# EAGLE design FeatherTPL5010 (EAGLE 9.6.2)
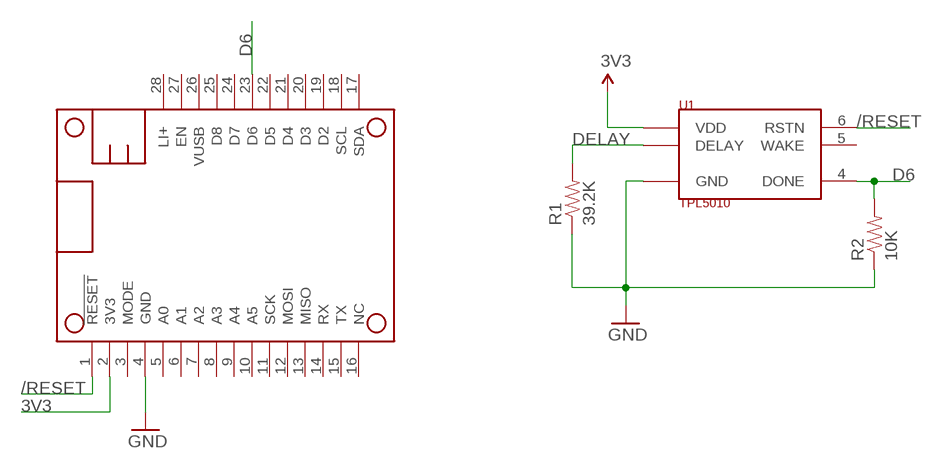
[diagram p0: schematic, sheet 1]

## Parts
MS1  FEATHERWING_NODIM  [FEATHERWING_NODIM]
R1  39.2K  RES-39.2K-0603  [0603-RES]
R2  10K  RES-10K-06030603  [0603-RES]
U1  TPL5010  [SOT-23-6-TI]

## Nets
3V3: MS1.2(3V3) U1.1(VDD)
/RESET: MS1.1(!RESET) U1.6(RSTN)
D6: MS1.23(D6) R2.2 U1.4(DONE)
DELAY: R1.2 U1.3(DELAY)
GND: MS1.4(GND) R1.1 R2.1 U1.2(GND)
Unconnected: MS1.3(MODE) MS1.5(A0) MS1.6(A1) MS1.7(A2) MS1.8(A3) MS1.9(A4) MS1.10(A5) MS1.11(SCK) MS1.12(MOSI) MS1.13(MISO) MS1.14(RX) MS1.15(TX) MS1.16(NC) MS1.17(SDA) MS1.18(SCL) MS1.19(D2) MS1.20(D3) MS1.21(D4) MS1.22(D5) MS1.24(D7) MS1.25(D8) MS1.26(VUSB) MS1.27(EN) MS1.28(LI+) U1.5(WAKE)

## Library data of the parts
MS1 = Particle-Mesh:FEATHERWING
R1 = rickk2:RES-39.2K-0603: RES SMD 39.2K OHM 1% 1/10W 0603 Panasonic Electronic Components ERJ-3EKF3922V $0.10 39.2 kOhms ±1% 0.1W, 1/10W Chip Resistor 0603 (1608 Metric) Automotive AEC-Q200 Thick Film https://www.digikey.com/product-detail/en/panasonic-electronic-components/ERJ-3EKF3922V/P39-2KHCT-ND/198362 Not ordered yet, but probably get 100
R2 = rickk2:RES-10K-0603: RES SMD 10K OHM 5% 1/4W 0603 $ 0.10 https://www.digikey.com/product-detail/en/panasonic-electronic-components/ERJ-PA3J103V/P10KBZCT-ND/5036237
U1 = rickk2:TPL5010: IC OSC PROG TIMER TSOT23-6 TI TPL5010DDCR $0.89 Programmable Timer IC TSOT-23-6 https://www.digikey.com/product-detail/en/texas-instruments/TPL5010DDCR/296-44392-1-ND/6110660 - Time controlled by resistant between pin 3 (DELAY/M_RST) and GND. - WAKE is timer output (not needed for this application) - RST is Open Drain - DONE is the pin the MCU uses to tickle the watchdog Timeouts: 1 min 22.02K 2 min 29.35K 3 min 34.73K 4 min 39.11K <- this might be a good choice for use with both Wi-Fi and cellular

## Board
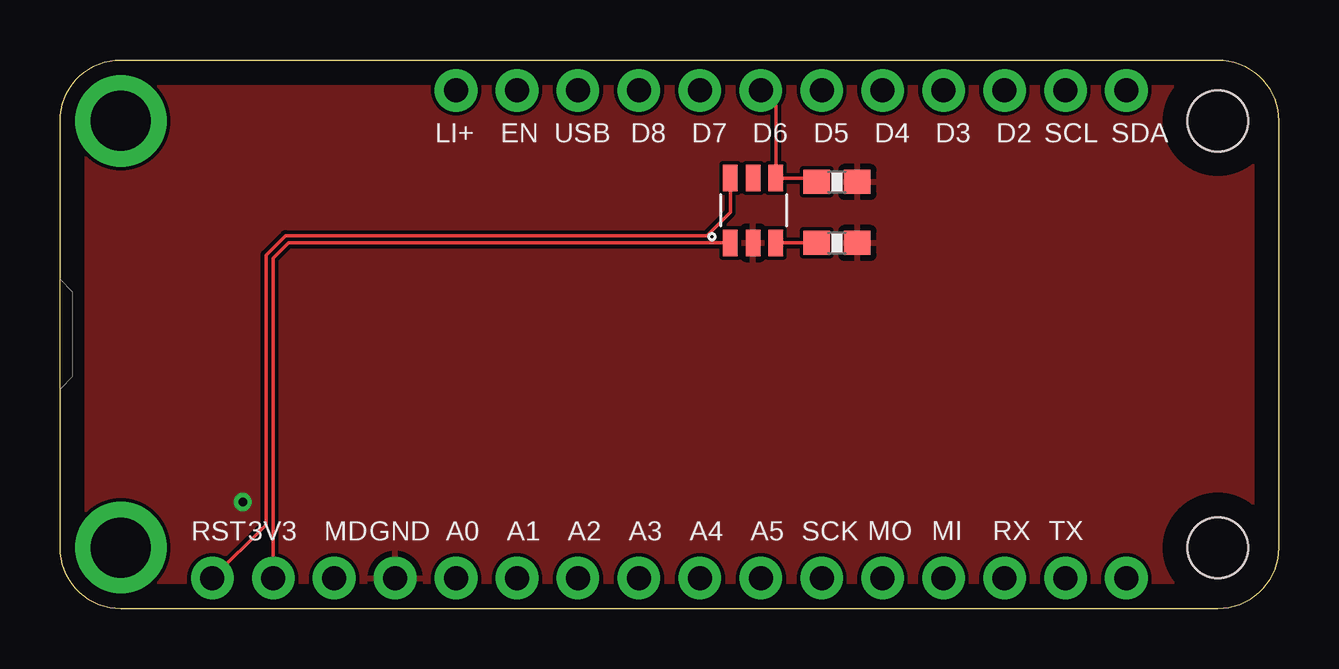
[diagram p1: board, top side]
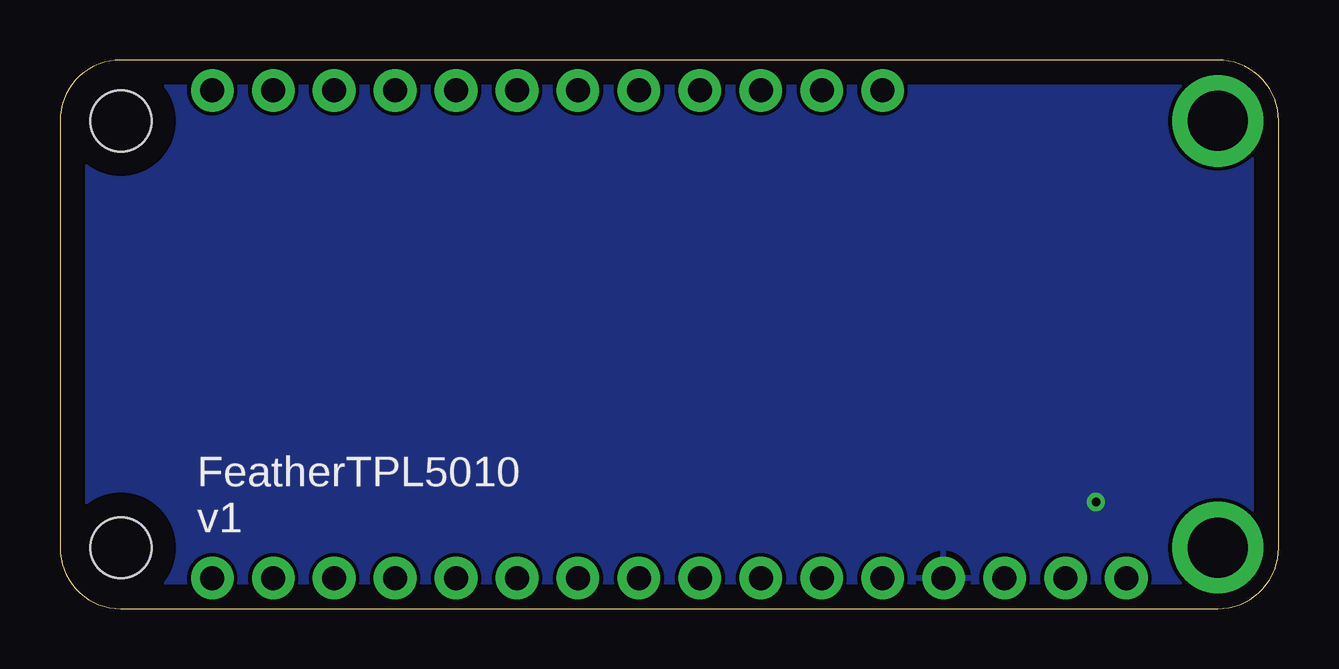
[diagram p2: board, bottom side, seen from below]

Size 50.8 x 22.86 mm. Coordinates in mm from the lower left corner, seen from the top.
Outline: 2.54,22.86 48.26,22.86 arc-90 50.8,20.32 50.8,2.54 arc-90 48.26,0 2.54,0 arc-90 0,2.54 0,20.32 arc-90 2.54,22.86
Copper layers (1*16): Top 0.035mm / dielectric 1.5mm / Bottom 0.035mm
Design rules "default": minimum track width 6mil, minimum drill 0.35mm, track to track 6mil, track to pad 6mil, pad to pad 6mil, via to via 6mil, smd to smd 6mil, copper to edge 40mil, drill to drill 6mil, minimum pad ring 10mil, minimum via ring 8mil, stop-mask expansion 4mil, vias tented up to drill 0mil, thermal gap 10mil

### Footprints (pad centres in the part's own frame; a part is rotated, then mirrored left to right if it is on the bottom)
FEATHERWING_NODIM = drill 1 pad 1.778: 1 6.35,1.27; 2 8.89,1.27; 3 11.43,1.27; 4 13.97,1.27; 5 16.51,1.27; 6 19.05,1.27; 7 21.59,1.27; 8 24.13,1.27; 9 26.67,1.27; 10 29.21,1.27; 11 31.75,1.27; 12 34.29,1.27; 13 36.83,1.27; 14 39.37,1.27; 15 41.91,1.27; 16 44.45,1.27; 17 44.45,21.59; 18 41.91,21.59; 19 39.37,21.59; 20 36.83,21.59; 21 34.29,21.59; 22 31.75,21.59; 23 29.21,21.59; 24 26.67,21.59; 25 24.13,21.59; 26 21.59,21.59; 27 19.05,21.59; 28 16.51,21.59 | drill 2.5 pad 3.81: P$1 2.54,20.32; P$2 2.54,2.54 | hole 2.54: 48.26,20.32; 48.26,2.54
0603-RES = smd 1.1 x 1: 1 -0.85,0; 2 0.85,0
SOT-23-6-TI = smd 0.6 x 1.1: 1 0,0; 2 0.95,0; 3 1.9,0; 4 1.9,2.7; 5 0.95,2.7; 6 0,2.7

### Placement (x,y rotation side)
MS1  0,0 0 top
R1  32.38,15.24 180 top
R2  32.38,17.78 180 top
U1  27.94,15.24 0 top

### Tracks (layer width: path | path; a pad name or v marks a point on that pad's centre or on a via)
3V3
  Top 0.152: MS1.2 8.89,14.61 9.53,15.24 U1.1
/RESET
  Top 0.152: MS1.1 8.59,3.5 8.59,14.73 9.4,15.54 26.98,15.54 27.94,16.51 U1.6
D6
  Top 0.152: R2.2 31.38,17.94 U1.4 29.84,20.96 MS1.23
DELAY
  Top 0.152: U1.3 R1.2
GND  (via drill 0.35)
  other vias: 7.62,4.45
  pour Top: 0,0 0,25.4 53.34,25.4 53.34,0
  pour Bottom: 0,0 0,27.94 50.8,27.94 50.8,0

### Text on the board
tPlace: LI+ | EN | USB | D8 | D7 | D6 | D5 | D4 | D3 | D2 | SCL | SDA | RST | 3V3 | MD | GND | A0 | A1 | A2 | A3 | A4 | A5 | SCK | MO | MI | RX | TX
bPlace: FeatherTPL5010 / v1